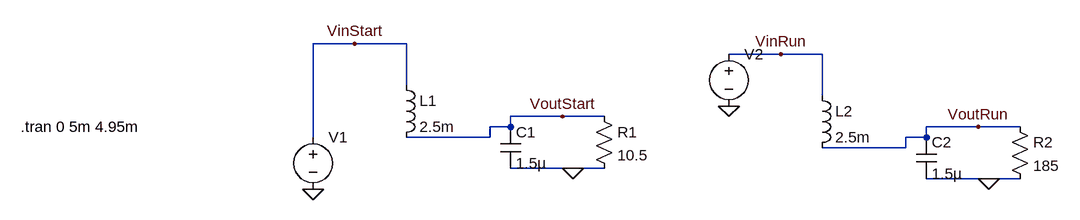
[diagram p0: schematic Final Stage Buck (400V - simpler design- expensive inductor.asc]
Final Stage Buck (400V - simpler design- expensive inductor.asc, the LTspice schematic file:
Version 4
SHEET 1 1236 680
WIRE 144 16 80 16
WIRE 224 16 144 16
WIRE 800 32 720 32
WIRE 864 32 800 32
WIRE 224 80 224 16
WIRE 864 96 864 32
WIRE 464 128 384 128
WIRE 528 128 464 128
WIRE 384 144 384 128
WIRE 384 144 352 144
WIRE 1104 144 1024 144
WIRE 1168 144 1104 144
WIRE 80 160 80 16
WIRE 352 160 352 144
WIRE 352 160 224 160
WIRE 1024 160 1024 144
WIRE 1024 160 992 160
WIRE 992 176 992 160
WIRE 992 176 864 176
WIRE 480 208 384 208
WIRE 528 208 480 208
WIRE 1120 224 1024 224
WIRE 1168 224 1120 224
FLAG 80 240 0
FLAG 480 208 0
FLAG 1120 224 0
FLAG 720 112 0
FLAG 144 16 VinStart
FLAG 800 32 VinRun
FLAG 464 128 VoutStart
FLAG 1104 144 VoutRun
SYMBOL voltage 80 144 R0
WINDOW 3 24 96 Invisible 2
WINDOW 123 0 0 Left 2
SYMATTR InstName V1
SYMATTR Value PULSE(0 400 0 1p 1p 1.425u 10u)
SYMATTR SpiceLine Rser=0
SYMBOL ind 208 64 R0
SYMATTR InstName L1
SYMATTR Value 2.5m
SYMATTR SpiceLine Rser=.044
SYMBOL cap 368 144 R0
SYMATTR InstName C1
SYMATTR Value 1.5µ
SYMATTR SpiceLine Rser=.1
SYMBOL res 512 112 R0
SYMATTR InstName R1
SYMATTR Value 10.5
SYMBOL ind 848 80 R0
SYMATTR InstName L2
SYMATTR Value 2.5m
SYMATTR SpiceLine Rser=.044
SYMBOL cap 1008 160 R0
SYMATTR InstName C2
SYMATTR Value 1.5µ
SYMATTR SpiceLine Rser=.1
SYMBOL res 1152 128 R0
SYMATTR InstName R2
SYMATTR Value 185
SYMBOL voltage 720 16 R0
WINDOW 3 24 96 Invisible 2
WINDOW 123 0 0 Left 2
SYMATTR InstName V2
SYMATTR Value PULSE(0 400 0 1p 1p 4.25u 10u)
SYMATTR SpiceLine Rser=0
TEXT -370 144 Left 2 !.tran 0 5m 4.95m

The netlist it stands for:
* Final Stage Buck (400V - simpler design- expensive inductor.asc
V1 VinStart 0 PULSE(0 400 0 1p 1p 1.425u 10u) Rser=0
L1 VinStart VoutStart 2.5m Rser=.044
C1 VoutStart 0 1.5µ Rser=.1
R1 VoutStart 0 10.5
L2 VinRun VoutRun 2.5m Rser=.044
C2 VoutRun 0 1.5µ Rser=.1
R2 VoutRun 0 185
V2 VinRun 0 PULSE(0 400 0 1p 1p 4.25u 10u) Rser=0
.tran 0 5m 4.95m
.backanno
.end